# Altium schematic sheet PyESPCar_Z1.SchDoc
size A4
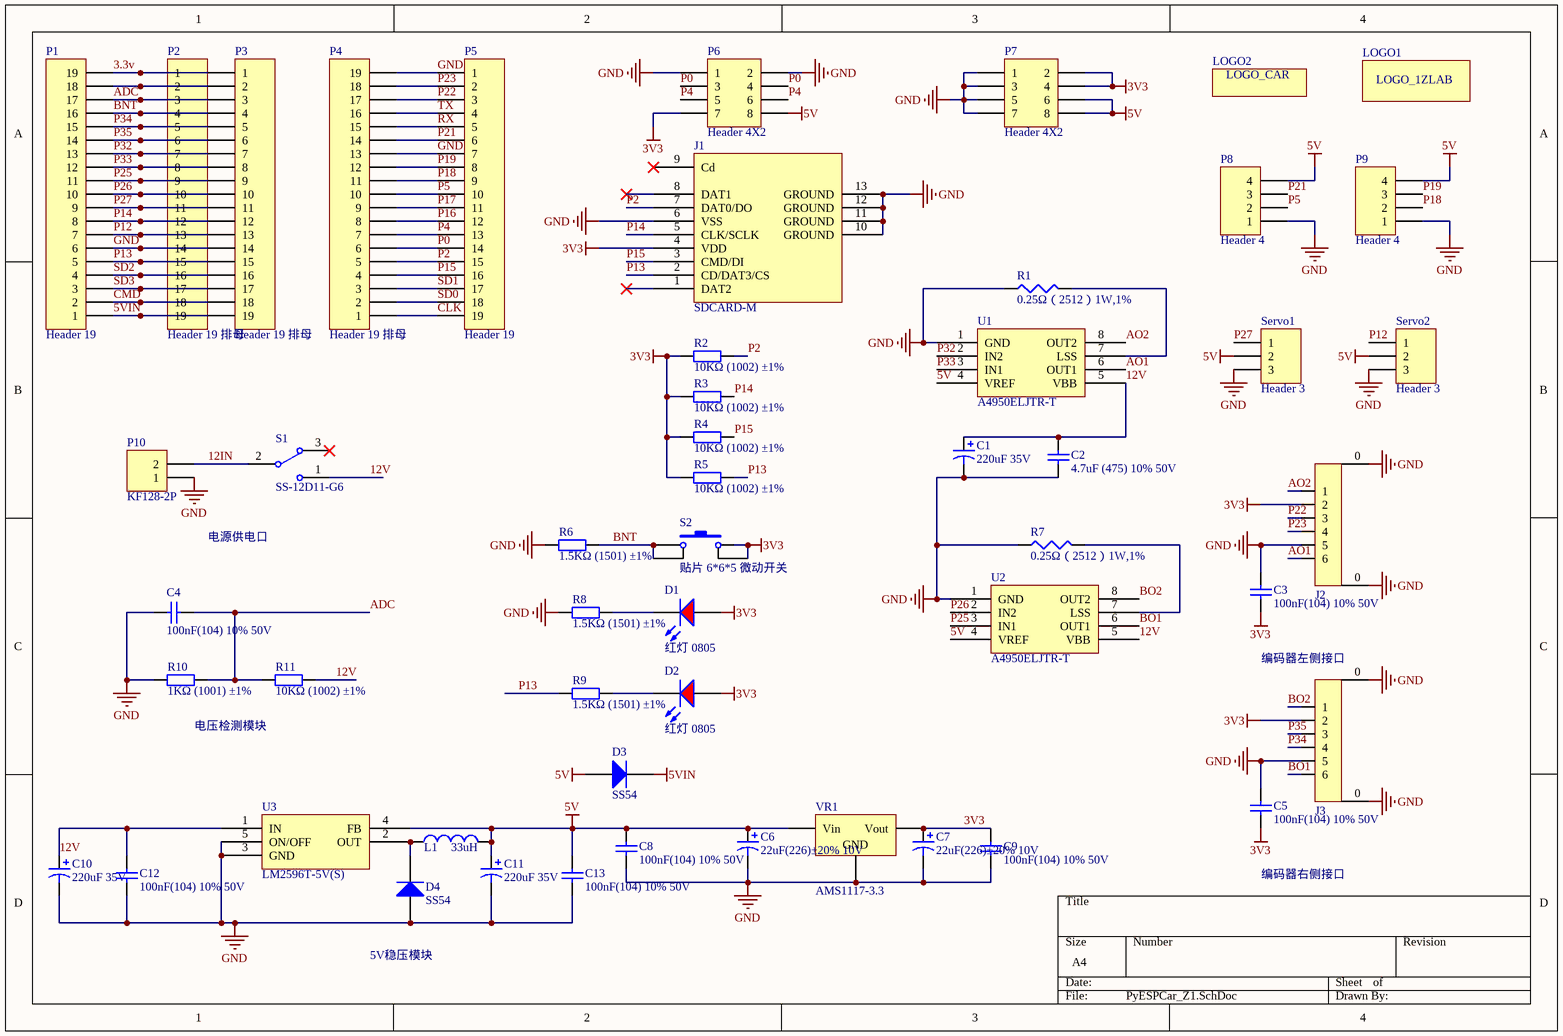
[diagram p0: PyESPCar_Z1.SchDoc]

## Parts
C1  220uF 35V  [CAPM8485X103N]
C2  4.7uF (475) 10% 50V  [1206_C]
C3  100nF(104) 10% 50V  [0805_C]
C4  100nF(104) 10% 50V  [0805_C]
C5  100nF(104) 10% 50V  [0805_C]
C6  22uF(226)±20% 10V  [CAP-3528]
C7  22uF(226)±20% 10V  [CAP-3528]
C8  100nF(104) 10% 50V  [0805_C]
C9  100nF(104) 10% 50V  [0805_C]
C10  220uF 35V  [CAPM8485X103N]
C11  220uF 35V  [CAPM8485X103N]
C12  100nF(104) 10% 50V  [0805_C]
C13  100nF(104) 10% 50V  [0805_C]
D1  红灯 0805  [0805_LED_S1]
D2  红灯 0805  [0805_LED_S1]
D3  SS54  [SMA(DO-214AC)_S1]
D4  SS54  [SMA(DO-214AC)_S1]
J1  SDCARD-M  [SDCARD-M]
J2  PH-PS-2.0-6  [PH-PS-2.0-6]  (value not drawn)
J3  PH-PS-2.0-6  [PH-PS-2.0-6]  (value not drawn)
L1  value 33uH  [CAPM100100X103N]  (hidden comment: 33uH ±20%)
LOGO1  LOGO_1ZLAB  [1ZLAB_LOGO]  (value not drawn)
LOGO2  LOGO_CAR  [car_logo]  (value not drawn)
P1  Header 19  [HDR1X19]
P2  Header 19 排母  [HDR1X19]
P3  Header 19 排母  [HDR1X19]
P4  Header 19 排母  [HDR1X19]
P5  Header 19  [HDR1X19]
P6  Header 4X2  [HDR2X4]
P7  Header 4X2  [HDR2X4]
P8  Header 4  [HDR1X4]
P9  Header 4  [HDR1X4]
P10  KF128-2P  [HDR2X1_D1]
R1  0.25Ω（2512）1W,1%  [2512]
R2  10KΩ (1002) ±1%  [0805_R]
R3  10KΩ (1002) ±1%  [0805_R]
R4  10KΩ (1002) ±1%  [0805_R]
R5  10KΩ (1002) ±1%  [0805_R]
R6  1.5KΩ (1501) ±1%  [0805_R]
R7  0.25Ω（2512）1W,1%  [2512]
R8  1.5KΩ (1501) ±1%  [0805_R]
R9  1.5KΩ (1501) ±1%  [0805_R]
R10  1KΩ (1001) ±1%  [0805_R]
R11  10KΩ (1002) ±1%  [0805_R]
S1  SS-12D11-G6  [SW-3]
S2  贴片 6*6*5 微动开关  [SW_PB4_A1]
Servo1  Header 3  [HDR1X3]
Servo2  Header 3  [HDR1X3]
U1  A4950ELJTR-T  [SOP-8_EP_150mil]
U2  A4950ELJTR-T  [SOP-8_EP_150mil]
U3  LM2596T-5V(S)  [TO-263-5]
VR1  AMS1117-3.3  [SOT-223]

## Nets
3V3: C3.2 C5.2 C7.1 C9.2 D1.A D2.A J1.4(VDD) J2.2 J3.2 P6.7 P7.2 P7.4 R2.1 R3.1 R4.1 R5.1 S2.2 S2.3 VR1.2(Vout)
5V: C6.1 C8.2 C11.1 C13.2 D3.1(A) L1.2 P6.8 P7.6 P7.8 P8.4 P9.4 Servo1.2 Servo2.2 U1.4(VREF) U2.4(VREF) U3.4(FB) VR1.3(Vin)
5VIN: D3.2(K) P1.1 P2.19 P3.19
GND: C1.2 C2.1 C3.1 C4.2 C5.1 C6.2 C7.2 C8.1 C9.1 C10.2 C11.2 C12.1 C13.1 D4.1(A) J1.6(VSS) J1.10(GROUND) J1.11(GROUND) J1.12(GROUND) J1.13(GROUND) J2.0 J2.5 J3.0 J3.5 P1.6 P2.14 P3.14 P4.13 P4.19 P5.1 P5.7 P6.1 P6.2 P7.1 P7.3 P7.5 P7.7 P8.1 P9.1 P10.1 R1.1 R6.1 R7.1 R8.1 R10.1 Servo1.3 Servo2.3 U1.1(GND) U2.1(GND) U3.3(GND) U3.5(ON/OFF) VR1.1(GND)
3.3v: P1.19 P2.1 P3.1
12IN: P10.2 S1.2
12V: C1.1 C2.2 C10.1 C12.2 R11.2 S1.1 U1.5(VBB) U2.5(VBB) U3.1(IN)
ADC: C4.1 P1.17 P2.3 P3.3 R10.2 R11.1
AO1: J2.6 U1.6(OUT1)
AO2: J2.1 U1.8(OUT2)
BNT: P1.16 P2.4 P3.4 R6.2 S2.1 S2.4
BO1: J3.6 U2.6(OUT1)
BO2: J3.1 U2.8(OUT2)
CLK: P4.1 P5.19
CMD: P1.2 P2.18 P3.18
P0: P4.6 P5.14 P6.3 P6.4
P2: J1.7(DAT0/DO) P4.5 P5.15 R2.2
P4: P4.7 P5.13 P6.5 P6.6
P5: P4.10 P5.10 P8.2
P12: P1.7 P2.13 P3.13 Servo2.1
P13: J1.2(CD/DAT3/CS) P1.5 P2.15 P3.15 R5.2 R9.1
P14: J1.5(CLK/SCLK) P1.8 P2.12 P3.12 R3.2
P15: J1.3(CMD/DI) P4.4 P5.16 R4.2
P16: P4.8 P5.12
P17: P4.9 P5.11
P18: P4.11 P5.9 P9.2
P19: P4.12 P5.8 P9.3
P21: P4.14 P5.6 P8.3
P22: J2.3 P4.17 P5.3
P23: J2.4 P4.18 P5.2
P25: P1.11 P2.9 P3.9 U2.3(IN1)
P26: P1.10 P2.10 P3.10 U2.2(IN2)
P27: P1.9 P2.11 P3.11 Servo1.1
P32: P1.13 P2.7 P3.7 U1.2(IN2)
P33: P1.12 P2.8 P3.8 U1.3(IN1)
P34: J3.4 P1.15 P2.5 P3.5
P35: J3.3 P1.14 P2.6 P3.6
RX: P4.15 P5.5
SD0: P4.2 P5.18
SD1: P4.3 P5.17
SD2: P1.4 P2.16 P3.16
SD3: P1.3 P2.17 P3.17
TX: P4.16 P5.4
NetD1_K: D1.K R8.2
NetD2_K: D2.K R9.2
NetD4_2: D4.2(K) L1.1 U3.2(OUT)
NetP1_18: P1.18 P2.2 P3.2
NetR1_2: R1.2 U1.7(LSS)
NetR7_2: R7.2 U2.7(LSS)

Not connected (* = marked no-connect by the designer): J1 1(DAT2)* 8(DAT1)* 9(Cd)*; S1 3*

## Notes on the sheet
- 电源供电口
- (near J3) 编码器左侧接口
- 电压检测模块
- 编码器右侧接口
- 5V稳压模块

## Library data of the parts
C1 = Cap Pol1: 贴片电解电容; Published: 8-Jun-2000; LatestRevisionDate: 17-Jul-2002; LatestRevisionNote: Re-released for DXP Platform.; PackageReference: RB7.6-15; Publisher: Altium Limited; PackageDescription: Polarized Capacitor (Radial); 2 Leads; Value: 220uF35V
C2 = 1206 4.7uF (475) 10% 50V: 贴片电容; ComponentLink1Description: 供应商链接; ComponentLink1URL: http://www.szlcsc.com/product/details_30577.html; Package: 1206; Supplier: LC; SuppliersPartNumber: C29823
C3-C5 C8 C9 C12 C13 = 0805 100nF(104) 10% 50V: 贴片电容; ComponentLink1Description: 供应商链接; ComponentLink1URL: http://www.szlcsc.com/product/details_50686.html; Package: 0805; Supplier: LC; SuppliersPartNumber: C49678
C6 C7 = Cap Pol: 钽电容; Vol: 16V; Published: 8-Jun-2000; LatestRevisionDate: 17-Jul-2002; LatestRevisionNote: Re-released for DXP Platform.; PackageReference: RB7.6-15; Publisher: Altium Limited; Value: 22uF(226)±20% 10V
C10 C11 = Cap Pol1: 贴片铝解电容; Published: 8-Jun-2000; LatestRevisionDate: 17-Jul-2002; LatestRevisionNote: Re-released for DXP Platform.; PackageReference: RB7.6-15; Publisher: Altium Limited; PackageDescription: Polarized Capacitor (Radial); 2 Leads; Value: 220uF35V
D1 D2 = 0805 红灯: 发光二极管; ComponentLink1Description: 供应商链接; ComponentLink1URL: http://www.szlcsc.com/product/details_2668.html; Package: 0805; Supplier: LC; SuppliersPartNumber: C2295
D3 D4 = SMA(DO-214AC) SS54: 二极管; ComponentLink1Description: 供应商链接; ComponentLink1URL: http://www.szlcsc.com/product/details_23178.html; Package: SMA(DO-214AC); Supplier: LC; SuppliersPartNumber: C22452
J1 = SDCARD-M: TF卡槽
L1 = Inductor: 功率电感 MS104R-330MT; Code_IEC: 1005; Published: 8-Jun-2000; LatestRevisionDate: 29-May-2009; LatestRevisionNote: IPC-7351 Footprint Added.; PackageReference: 0402-A; Publisher: Altium Limited; PackageDescription: Chip Inductor; Code_JEITA: 0402
P1 P5 = Header 19: Header, 19-Pin 排针; LatestRevisionDate: 17-Jul-2002; LatestRevisionNote: Re-released for DXP Platform.; Publisher: Altium Limited
P2-P4 = Header 19: Header, 19-Pin 排母; LatestRevisionDate: 17-Jul-2002; LatestRevisionNote: Re-released for DXP Platform.; Publisher: Altium Limited
P6 P7 = Header 4X2: Header, 4-Pin, Dual row; LatestRevisionDate: 17-Jul-2002; LatestRevisionNote: Re-released for DXP Platform.; Publisher: Altium Limited
P8 P9 = Header 4: Header, 4-Pin; LatestRevisionDate: 17-Jul-2002; LatestRevisionNote: Re-released for DXP Platform.; Publisher: Altium Limited
P10 = Header 2: 5.08mm端子; LatestRevisionDate: 17-Jul-2002; LatestRevisionNote: Re-released for DXP Platform.; Publisher: Altium Limited
R1 R7 = Res3: 超低阻值电阻; Value: 0.25Ω; Published: 8-Jun-2000; LatestRevisionDate: 29-May-2009; LatestRevisionNote: IPC-7351 Footprint Added.; PackageReference: J1-0603; Publisher: Altium Limited; PackageDescription: Chip Resistor
R2-R5 R10 R11 = 0805 1KΩ (1001) 1%: 贴片电阻; ComponentLink1Description: 供应商链接; ComponentLink1URL: http://www.szlcsc.com/product/details_18201.html; Package: 0805; Supplier: LC; SuppliersPartNumber: C17513
R6 R8 R9 = 0603 1.5KΩ (1501) 1%: 贴片电阻; ComponentLink1Description: 供应商链接; ComponentLink1URL: http://www.szlcsc.com/product/details_23570.html; Package: 0603; Supplier: LC; SuppliersPartNumber: C22843
S1 = SW-SPDT: 拨动开关2档带固定脚黑色短柄 3脚侧; Published: 24-Mar-1999; LatestRevisionDate: 17-Dec-2003; LatestRevisionNote: Schematic revised, PCB Footprint replaced.; DatasheetVersion: 05-Dec-2000; PackageReference: TL36WW15050; Publisher: Altium Limited; PackageDescription: Switch; 4 Leads; ComponentLink1Description: Manufacturer Link; ComponentLink1URL: http://www.apem.com
S2 = SW-PB4: Published: 24-Mar-1999; LatestRevisionDate: 17-Jul-2002; LatestRevisionNote: Re-released for DXP Platform.; PackageReference: SPST-2; Publisher: Altium Limited
Servo1 Servo2 = Header 3: Header, 3-Pin; LatestRevisionDate: 17-Jul-2002; LatestRevisionNote: Re-released for DXP Platform.; Publisher: Altium Limited
U1 = A4950: A4950 电机驱动
U2 = A4950: A4950电机驱动
U3 = LM2596T-5V(S): 稳压芯片
VR1 = SOT-223 AMS1117-3.3: 低压差线性稳压(LDO); ComponentLink1Description: 供应商链接; ComponentLink1URL: http://www.szlcsc.com/product/details_6652.html; Package: SOT-223; Supplier: LC; SuppliersPartNumber: C6186